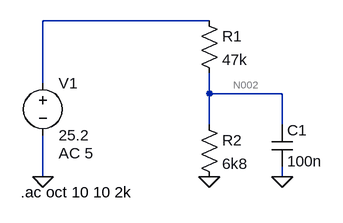
[diagram p0: schematic extvoltmonitor.asc]
extvoltmonitor.asc, the LTspice schematic file:
Version 4
SHEET 1 880 680
WIRE 288 0 32 0
WIRE 32 96 32 0
WIRE 288 112 288 80
WIRE 400 112 288 112
WIRE 288 160 288 112
WIRE 400 160 400 112
WIRE 32 240 32 176
WIRE 400 240 400 224
FLAG 32 240 0
FLAG 288 240 0
FLAG 400 240 0
SYMBOL voltage 32 80 R0
WINDOW 123 24 124 Left 2
WINDOW 39 0 0 Left 2
SYMATTR InstName V1
SYMATTR Value 25.2
SYMATTR Value2 AC 5
SYMBOL res 272 -16 R0
SYMATTR InstName R1
SYMATTR Value 47k
SYMBOL res 272 144 R0
SYMATTR InstName R2
SYMATTR Value 6k8
SYMBOL cap 384 160 R0
SYMATTR InstName C1
SYMATTR Value 100n
TEXT -2 264 Left 2 !.ac oct 10 10 2k

The netlist it stands for:
* extvoltmonitor.asc
V1 N001 0 25.2 AC 5
R1 N001 N002 47k
R2 N002 0 6k8
C1 N002 0 100n
.ac oct 10 10 2k
.backanno
.end

* Results of the author's LTspice run, read from the files saved beside the schematic
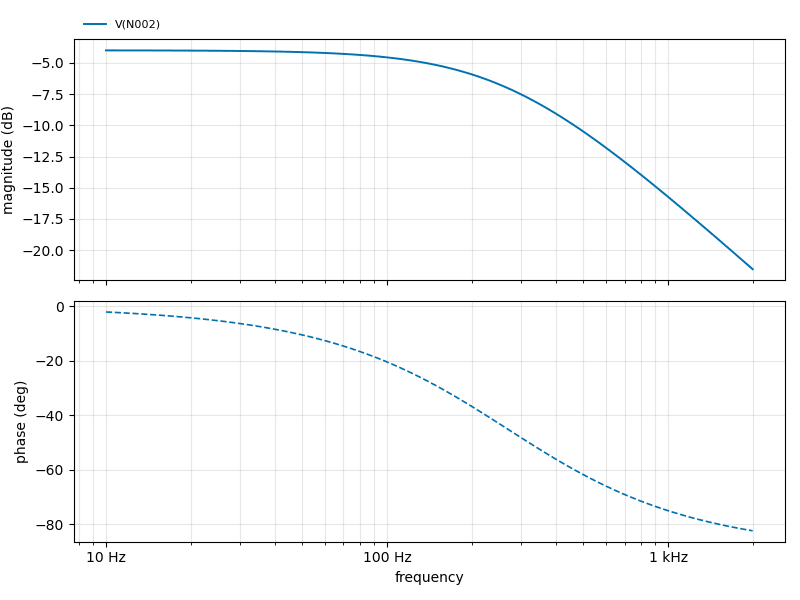
[diagram p1: AC Analysis of extvoltmonitor.asc, plotted from the saved traces]
* AC Analysis, 1 run:
*   V(N002): -3.99 dB at 10 Hz, -21.52 dB at 2 kHz, peak -3.99 dB at 10 Hz, 3 dB below the peak at 268.1 Hz